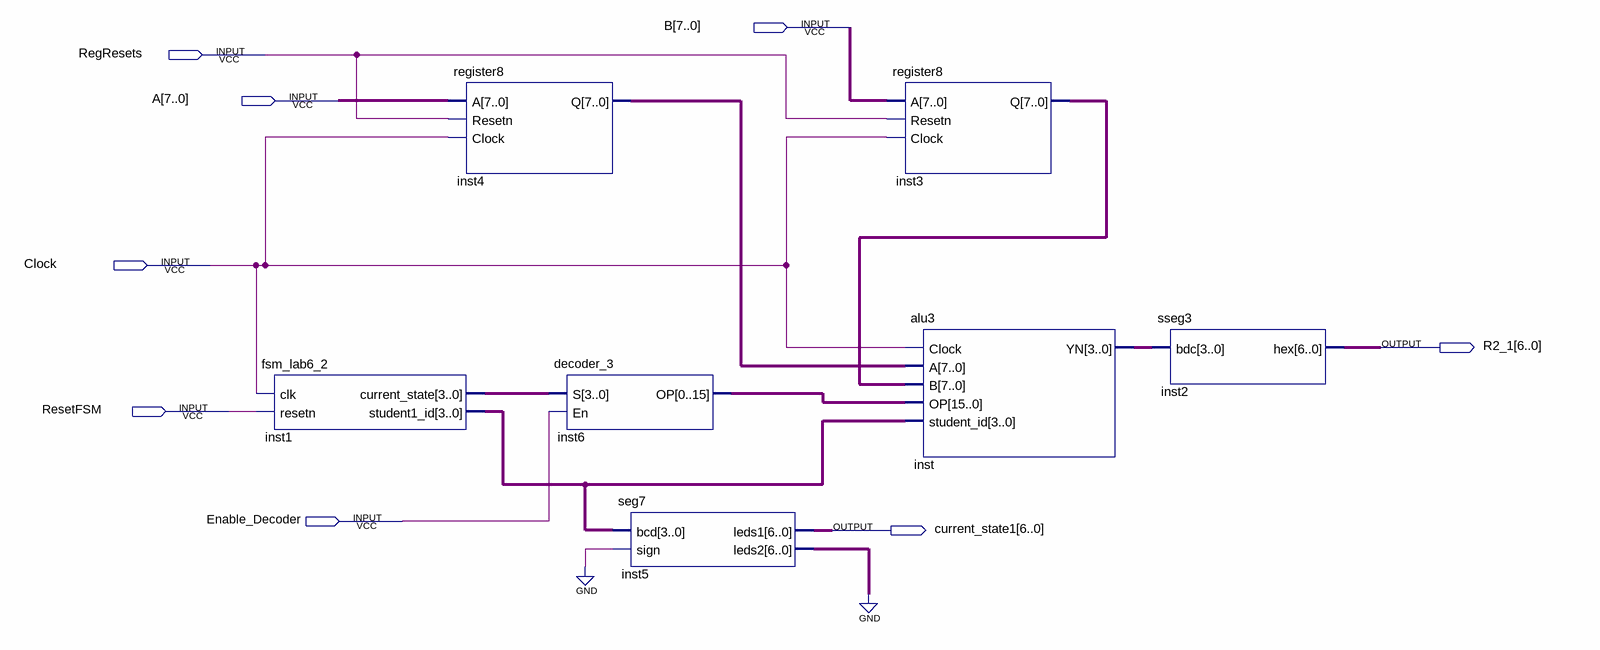
[diagram p0: schematic sheet]
// Quartus schematic lab6_3.bdf as structural Verilog: 7 symbols, 8 pins
module lab6_3 (
  input  [7:0] B,
  input  RegResets,
  input  [7:0] A,
  input  Clock,
  input  ResetFSM,
  input  Enable_Decoder,
  output [6:0] R2_1,
  output [6:0] current_state1
);

  wire [3:0] inst1_current_state, inst1_student1_id, inst_yn;
  wire [6:0] inst5_leds2;
  wire [7:0] inst3_q, inst4_q;
  wire [15:0] inst6_op;

  fsm_lab6_2 inst1 (
    .clk(Clock), .resetn(ResetFSM), .current_state(inst1_current_state), .student1_id(inst1_student1_id));
  register8 inst4 (.A(A), .Resetn(RegResets), .Clock(Clock), .Q(inst4_q));
  decoder_3 inst6 (.S(inst1_current_state), .En(Enable_Decoder), .OP(inst6_op));
  seg7 inst5 (.bcd(inst1_student1_id), .sign(1'b0), .leds1(current_state1), .leds2(inst5_leds2));
  register8 inst3 (.A(B), .Resetn(RegResets), .Clock(Clock), .Q(inst3_q));
  alu3 inst (.Clock(Clock), .A(inst4_q), .B(inst3_q), .OP(inst6_op), .student_id(inst1_student1_id), .YN(inst_yn));
  sseg3 inst2 (.bdc(inst_yn), .hex(R2_1));
  // also tied to GND on the sheet: {inst5_leds2[0], inst5_leds2[1], inst5_leds2[2], inst5_leds2[3], inst5_leds2[4], inst5_leds2[5], inst5_leds2[6]}
endmodule
